# Altium schematic sheet Led_CTR.SchDoc
size A3; CompanyName: Anfaengineering; Organization: Anfaengineering; Address1: Timisoara; Address2: Romania; SheetNumber: 4; SheetTotal: 5
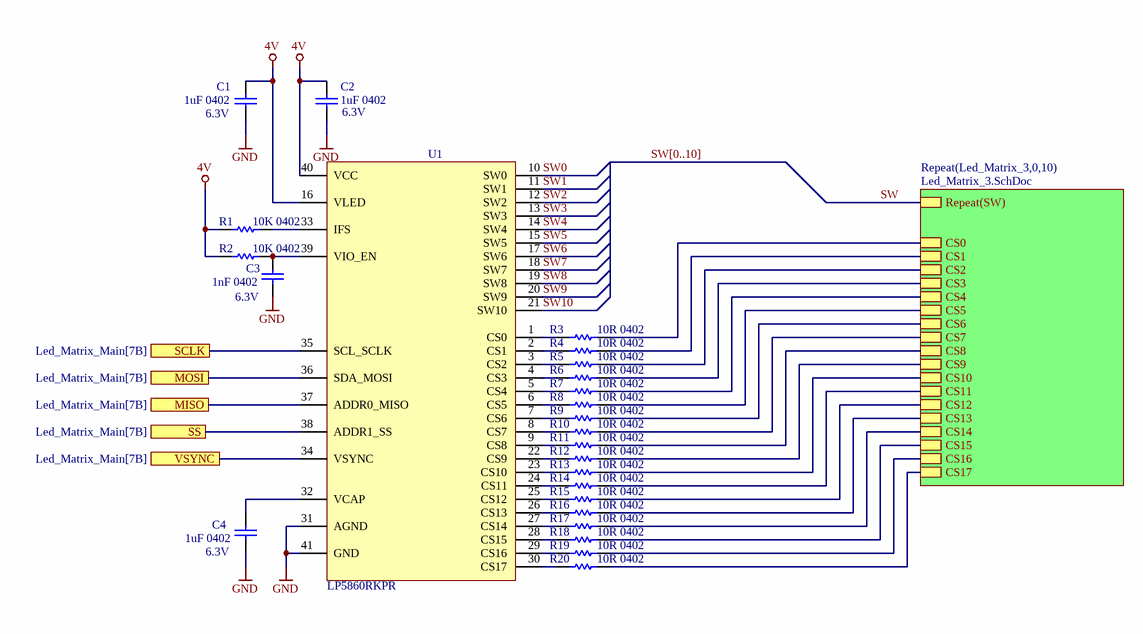
[diagram p0: Led_CTR.SchDoc]

## Parts
C1  1uF 0402  Voltage: 6.3V  [CAPC0402(1005)70]
C2  1uF 0402  Voltage: 6.3V  [CAPC0402(1005)70]
C3  1nF 0402  Voltage: 6.3V  [CAPC0402(1005)70]
C4  1uF 0402  Voltage: 6.3V  [CAPC0402(1005)70]
R1  10K 0402  [RESC0402(1005)]
R2  10K 0402  [RESC0402(1005)]
R3  10R 0402  [RESC0402(1005)]
R4  10R 0402  [RESC0402(1005)]
R5  10R 0402  [RESC0402(1005)]
R6  10R 0402  [RESC0402(1005)]
R7  10R 0402  [RESC0402(1005)]
R8  10R 0402  [RESC0402(1005)]
R9  10R 0402  [RESC0402(1005)]
R10  10R 0402  [RESC0402(1005)]
R11  10R 0402  [RESC0402(1005)]
R12  10R 0402  [RESC0402(1005)]
R13  10R 0402  [RESC0402(1005)]
R14  10R 0402  [RESC0402(1005)]
R15  10R 0402  [RESC0402(1005)]
R16  10R 0402  [RESC0402(1005)]
R17  10R 0402  [RESC0402(1005)]
R18  10R 0402  [RESC0402(1005)]
R19  10R 0402  [RESC0402(1005)]
R20  10R 0402  [RESC0402(1005)]
U1  LP5860RKPR  [VQFN-40]

## Sub-sheets
Repeat(Led_Matrix_3,0,10) = Led_Matrix_3.SchDoc: CS0, CS1, CS2, CS3, CS4, CS5, CS6, CS7, CS8, CS9, CS10, CS11, CS12, CS13, CS14, CS15, CS16, CS17, Repeat(SW)

## Ports
MISO (see Led_Matrix_Main[7B]), MOSI (see Led_Matrix_Main[7B]), SCLK (see Led_Matrix_Main[7B]), SS (see Led_Matrix_Main[7B]), VSYNC (see Led_Matrix_Main[7B])

## Nets
4V: C1.2 C2.2 R1.1 R2.1 U1.16(VLED) U1.40(VCC)
GND: C1.1 C2.1 C3.2 C4.1 U1.31(AGND) U1.41(GND)
MISO: U1.37(ADDR0_MISO) ; port MISO
MOSI: U1.36(SDA_MOSI) ; port MOSI
SCLK: U1.35(SCL_SCLK) ; port SCLK
SS: U1.38(ADDR1_SS) ; port SS
SW: sheet Repeat(Led_Matrix_3,0,10)/Repeat(SW)
SW0: U1.10(SW0)
SW1: U1.11(SW1)
SW2: U1.12(SW2)
SW3: U1.13(SW3)
SW4: U1.14(SW4)
SW5: U1.15(SW5)
SW6: U1.17(SW6)
SW7: U1.18(SW7)
SW8: U1.19(SW8)
SW9: U1.20(SW9)
SW10: U1.21(SW10)
VSYNC: U1.34(VSYNC) ; port VSYNC
NetC3_1: C3.1 R2.2 U1.39(VIO_EN)
NetC4_2: C4.2 U1.32(VCAP)
NetR1_2: R1.2 U1.33(IFS)
NetR3_1: R3.1 U1.1(CS0)
NetR3_2: R3.2 ; sheet Repeat(Led_Matrix_3,0,10)/CS0
NetR4_1: R4.1 U1.2(CS1)
NetR4_2: R4.2 ; sheet Repeat(Led_Matrix_3,0,10)/CS1
NetR5_1: R5.1 U1.3(CS2)
NetR5_2: R5.2 ; sheet Repeat(Led_Matrix_3,0,10)/CS2
NetR6_1: R6.1 U1.4(CS3)
NetR6_2: R6.2 ; sheet Repeat(Led_Matrix_3,0,10)/CS3
NetR7_1: R7.1 U1.5(CS4)
NetR7_2: R7.2 ; sheet Repeat(Led_Matrix_3,0,10)/CS4
NetR8_1: R8.1 U1.6(CS5)
NetR8_2: R8.2 ; sheet Repeat(Led_Matrix_3,0,10)/CS5
NetR9_1: R9.1 U1.7(CS6)
NetR9_2: R9.2 ; sheet Repeat(Led_Matrix_3,0,10)/CS6
NetR10_1: R10.1 U1.8(CS7)
NetR10_2: R10.2 ; sheet Repeat(Led_Matrix_3,0,10)/CS7
NetR11_1: R11.1 U1.9(CS8)
NetR11_2: R11.2 ; sheet Repeat(Led_Matrix_3,0,10)/CS8
NetR12_1: R12.1 U1.22(CS9)
NetR12_2: R12.2 ; sheet Repeat(Led_Matrix_3,0,10)/CS9
NetR13_1: R13.1 U1.23(CS10)
NetR13_2: R13.2 ; sheet Repeat(Led_Matrix_3,0,10)/CS10
NetR14_1: R14.1 U1.24(CS11)
NetR14_2: R14.2 ; sheet Repeat(Led_Matrix_3,0,10)/CS11
NetR15_1: R15.1 U1.25(CS12)
NetR15_2: R15.2 ; sheet Repeat(Led_Matrix_3,0,10)/CS12
NetR16_1: R16.1 U1.26(CS13)
NetR16_2: R16.2 ; sheet Repeat(Led_Matrix_3,0,10)/CS13
NetR17_1: R17.1 U1.27(CS14)
NetR17_2: R17.2 ; sheet Repeat(Led_Matrix_3,0,10)/CS14
NetR18_1: R18.1 U1.28(CS15)
NetR18_2: R18.2 ; sheet Repeat(Led_Matrix_3,0,10)/CS15
NetR19_1: R19.1 U1.29(CS16)
NetR19_2: R19.2 ; sheet Repeat(Led_Matrix_3,0,10)/CS16
NetR20_1: R20.1 U1.30(CS17)
NetR20_2: R20.2 ; sheet Repeat(Led_Matrix_3,0,10)/CS17

## Buses and harness runs
bus SW[0..10]

## Library data of the parts
C1 C2 C4 = C_1uF_0402_6.3V_X5R: Surface Mount Ceramic Multilayer Capacitor 1uF, ± 20%, X5R, 6.3V, 0402; Manufacturer: Murata; Manufacturer Part Number: GRM153R60J105ME15D; Anfa_PN: ALC0088; Component loss: 20; Min Operating Temperature: -55°C; Max Operating Temperature: 85°C; Tolerance: 20%; Supplier Part Number 1: 81-GRM153R60J105ME1D; Supplier 1: Mouser; Price: 0.042; Value: 1uF 0402
C3 = C_1nF_0402_6.3V_X7R: Surface Mount Ceramic Multilayer Capacitor 1nF, ± 10%, X7R, 6.3V, 0402; Manufacturer: Murata; Manufacturer Part Number: GRM155R70J102KA01D; Anfa_PN: QC0025; Component loss: 20; Min Operating Temperature: -55°C; Max Operating Temperature: 125°C; Tolerance: 10%; Price: 0.035; Value: 1nF 0402; Supplier 1: Mouser; Supplier Part Number 1: 81-GRM155R70J102KA1D
R1 R2 = R_10K_0402_1%: Resistor: thick film; SMD; 0402; 10KΩ; 63mW; ±1%; -55÷155°C; Manufacturer: Vishay; Manufacturer Part Number: CRCW040210K0FKTDBC; Anfa_PN: ALR0134; Component loss: 20; Tolerance: 1%; Supplier 1: TME; Supplier Part Number 1: CRCW040210K0FKTDBC; Max Operating Temperature: 155°C; Min Operating Temperature: -55°C; Power: 63 mW; Price: 0.0085; Value: 10K 0402
R3-R20 = R_10R_0402_1%: Resistor: thick film; SMD; 0402; 10Ω; 63mW; ±1%; -55÷155°C; Manufacturer: Royal Electronic Factory; Manufacturer Part Number: 0402WGF100JTCE; Anfa_PN: ALR0137; Component loss: 20; Supplier 1: TME; Supplier Part Number 1: SMD0402-10R-1%; Max Operating Temperature: 155°C; Min Operating Temperature: -55°C; Power: 63 mW; Price: 0.0095; Tolerance: 1%; Value: 10R 0402
U1 = IC_LED_DRIVER_LP5860RKPR: 11 × 18 LED matrix driver with 8-bit analog and 8-/16-bit PWM dimming 40-VQFN -40 to 85; Manufacturer: Texas Instruments; Anfa_PN: QIC0023; Min Input Voltage: 2.7V; Max Input Voltage: 5.5V; Component loss: 1; No. of pins: 40; Manufacturer Part Number: LP5860RKPR; Min Operating Temperature: -40 °C; Max Operating Temperature: 85 °C; Price: 3.06; Value: LP5860RKPR; Supplier 1: Mouser; Supplier Part Number 1: 595-LP5860RKPR